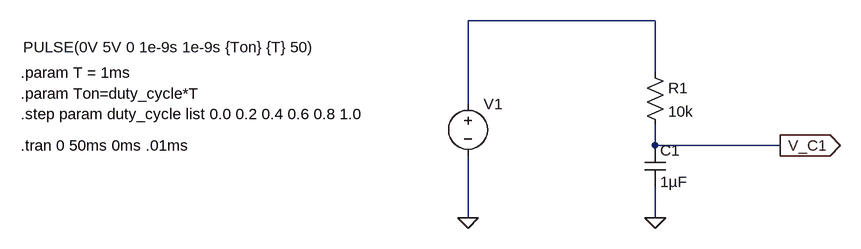
[diagram p0: schematic RC-lowpass_PWM_V001.asc]
RC-lowpass_PWM_V001.asc, the LTspice schematic file:
Version 4
SHEET 1 880 680
WIRE 240 -16 -48 -16
WIRE 240 64 240 -16
WIRE -48 112 -48 -16
WIRE 240 176 240 144
WIRE 432 176 240 176
WIRE -48 288 -48 192
WIRE 240 288 240 240
FLAG 240 288 0
FLAG -48 288 0
FLAG 432 176 V_C1
IOPIN 432 176 Out
DATAFLAG 320 176 ""
SYMBOL cap 224 176 R0
SYMATTR InstName C1
SYMATTR Value 1µF
SYMBOL res 224 48 R0
SYMATTR InstName R1
SYMATTR Value 10k
SYMBOL voltage -48 96 R0
WINDOW 3 -684 -71 Left 2
WINDOW 123 0 0 Left 0
WINDOW 39 0 0 Left 0
SYMATTR Value PULSE(0V 5V 0 1e-9s 1e-9s {Ton} {T} 50)
SYMATTR InstName V1
TEXT -736 176 Left 2 !.tran 0 50ms 0ms .01ms
TEXT -736 64 Left 2 !.param T = 1ms
TEXT -736 96 Left 2 !.param Ton=duty_cycle*T
TEXT -736 128 Left 2 !.step param duty_cycle list 0.0 0.2 0.4 0.6 0.8 1.0

The netlist it stands for:
* RC-lowpass_PWM_V001.asc
C1 V_C1 0 1µF
R1 N001 V_C1 10k
V1 N001 0 PULSE(0V 5V 0 1e-9s 1e-9s {Ton} {T} 50)
.tran 0 50ms 0ms .01ms
.param T = 1ms
.param Ton=duty_cycle*T
.step param duty_cycle list 0.0 0.2 0.4 0.6 0.8 1.0
.backanno
.end